# Altium schematic sheet CAN_PHY.SchDoc
size 420 x 297 mm; SheetNumber: 22; SheetTotal: 32
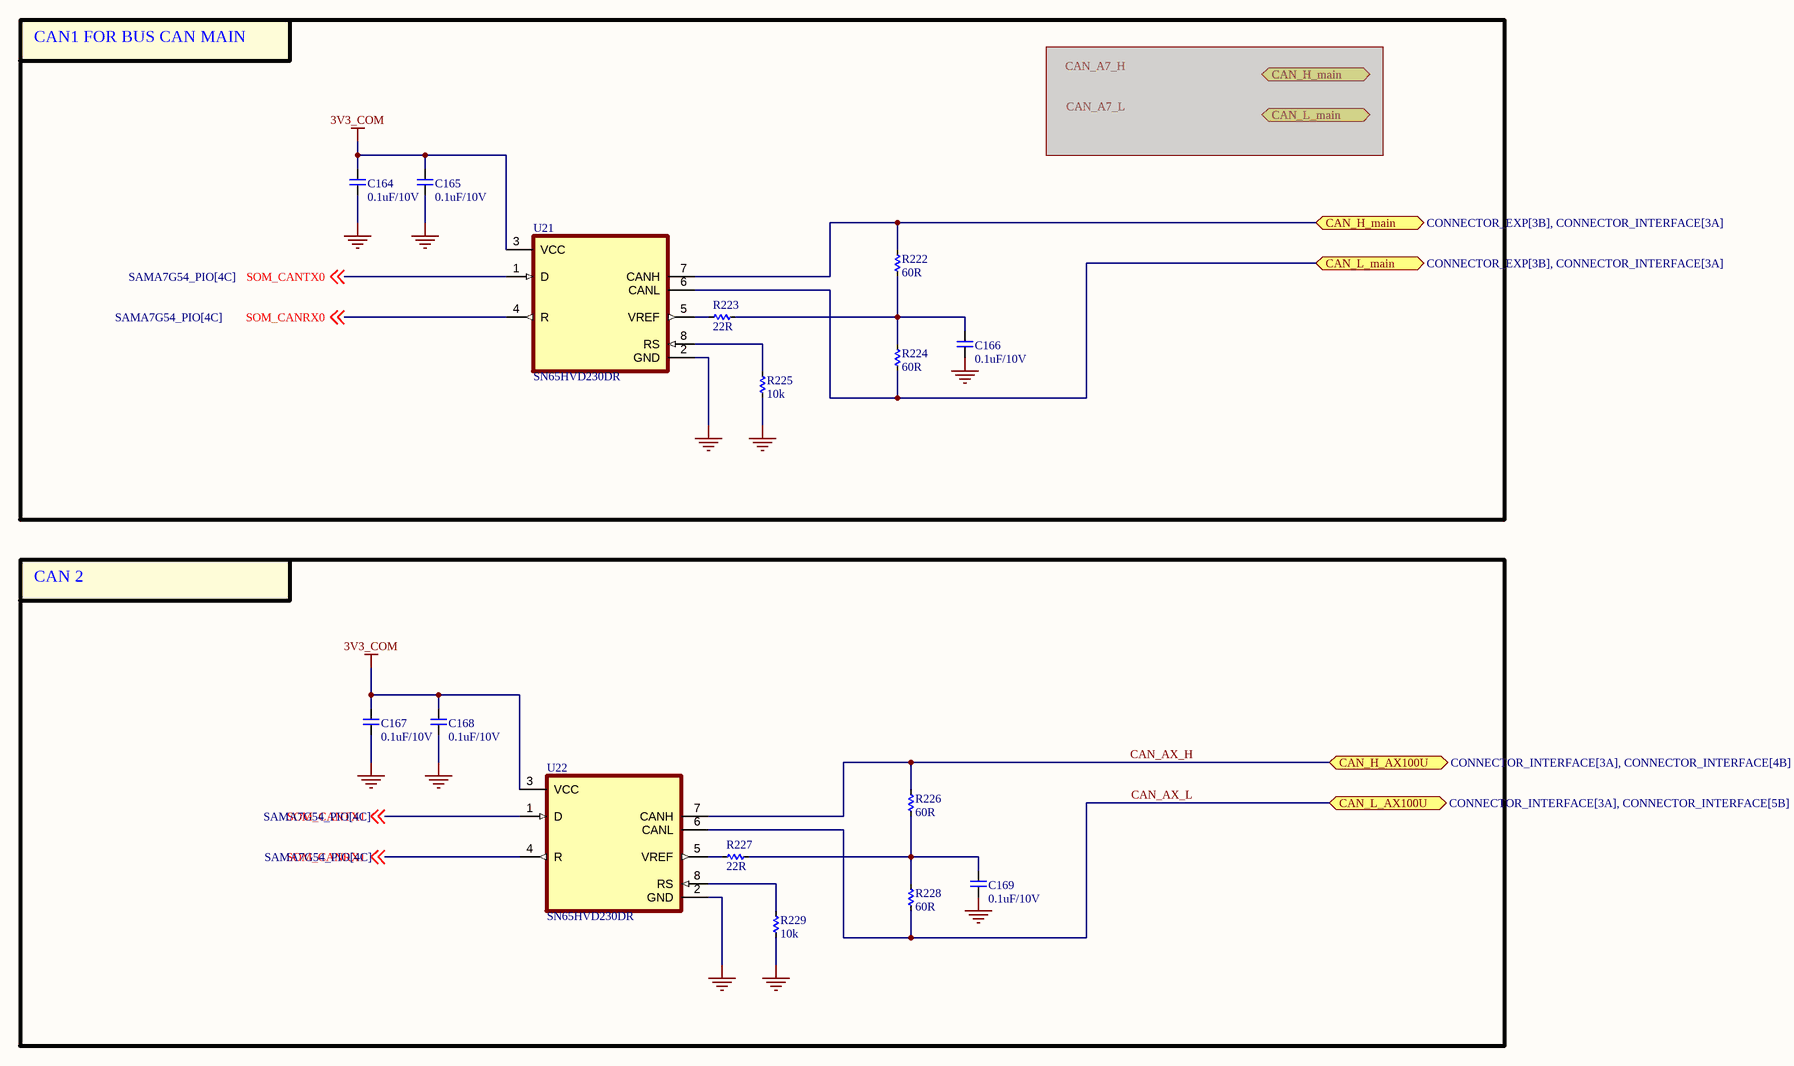
[diagram p0: CAN_PHY.SchDoc]

## Parts
C164  0.1uF/10V  [CAP_C_1005X50_L]
C165  0.1uF/10V  [CAP_C_1005X50_L]
C166  0.1uF/10V  [CAP_C_1005X50_L]
C167  0.1uF/10V  [CAP_C_1005X50_L]
C168  0.1uF/10V  [CAP_C_1005X50_L]
C169  0.1uF/10V  [CAP_C_1005X50_L]
R222  60R  [RES_C_1005x30_L]
R223  22R  [RES_C_1005x30_L]
R224  60R  [RES_C_1005x30_L]
R225  10k  [RES_C_1005x30_L]
R226  60R  [RES_C_1005x30_L]
R227  22R  [RES_C_1005x30_L]
R228  60R  [RES_C_1005x30_L]
R229  10k  [RES_C_1005x30_L]
U21  SN65HVD230DR  [SOIC127P602X173-8N]
U22  SN65HVD230DR  [SOIC127P602X173-8N]

## Blocks framed on the sheet
CAN1 FOR BUS CAN MAIN: C164-C166 R222-R225 U21
CAN 2: C167-C169 R226-R229 U22

## Ports
CAN_H_AX100U (bidir, see CONNECTOR_INTERFACE[3A], CONNECTOR_INTERFACE[4B]), CAN_H_main (bidir, see CAN_PHY[5A], CONNECTOR_EXP[4B], CONNECTOR_INTERFACE[4A]), CAN_H_main (bidir, see CONNECTOR_EXP[3B], CONNECTOR_INTERFACE[3A]), CAN_L_AX100U (bidir, see CONNECTOR_INTERFACE[3A], CONNECTOR_INTERFACE[5B]), CAN_L_main (bidir, see CAN_PHY[5A], CONNECTOR_EXP[4B], CONNECTOR_INTERFACE[4A]), CAN_L_main (bidir, see CONNECTOR_EXP[3B], CONNECTOR_INTERFACE[3A])

## Nets
3V3_COM: C164.2 C165.2 C167.2 C168.2 U21.3(VCC) U22.3(VCC)
GND: C164.1 C165.1 C166.1 C167.1 C168.1 C169.1 R225.2 R229.2 U21.2(GND) U22.2(GND)
CAN_AX_H: R226.1 U22.7(CANH) ; port CAN_H_AX100U
CAN_AX_L: R228.2 U22.6(CANL) ; port CAN_L_AX100U
CAN_H_main: R222.1 U21.7(CANH) ; port CAN_H_main
CAN_L_main: R224.2 U21.6(CANL) ; port CAN_L_main
SOM_CANRX0: U21.4(R) ; off-sheet SOM_CANRX0
SOM_CANRX1: U22.4(R) ; off-sheet SOM_CANRX1
SOM_CANTX0: U21.1(D) ; off-sheet SOM_CANTX0
SOM_CANTX1: U22.1(D) ; off-sheet SOM_CANTX1
NetC166_2: C166.2 R222.2 R223.1 R224.1
NetC169_2: C169.2 R226.2 R227.1 R228.1
NetR223_2: R223.2 U21.5(VREF)
NetR225_1: R225.1 U21.8(RS)
NetR227_2: R227.2 U22.5(VREF)
NetR229_1: R229.1 U22.8(RS)

## Notes on the sheet
- Project:
- Sub-system:
- Design by:
- Sheet title:
- Sheet
- A3
- of
- Checked by:
- Approved by:
- Revision:
- Document No:
- Size:
- Date:

## Library data of the parts
C164-C169 = _CAP_C_2: CAP
R222-R229 = _RES_B_2: RES
U21 U22 = SN65HVD230DR: 3.3 V CAN Transceiver with Standby Mode; MF: Texas Instruments; SnapEDA_Link: https://www.snapeda.com/parts/SN65HVD230DR/Texas+Instruments/view-part/?ref=snap; Package: SOIC-8 Texas Instruments; Value: *; MP: SN65HVD230DR; Check_prices: https://www.snapeda.com/parts/SN65HVD230DR/Texas+Instruments/view-part/?ref=eda